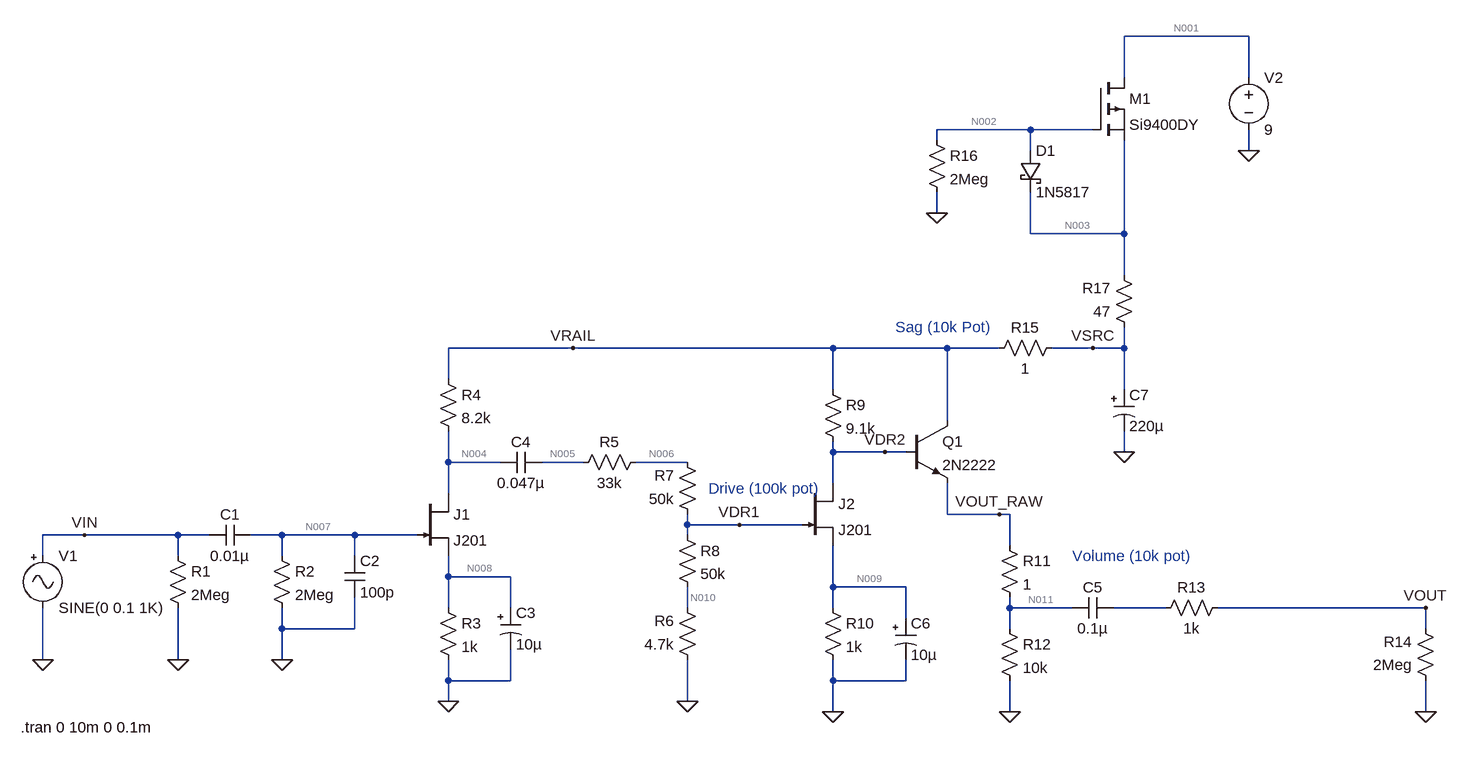
[diagram p0: schematic fairfield_barbershop.asc]
fairfield_barbershop.asc, the LTspice schematic file:
Version 4
SHEET 1 2060 680
WIRE 1664 -608 1472 -608
WIRE 1472 -544 1472 -608
WIRE 1664 -544 1664 -608
WIRE 1328 -464 1184 -464
WIRE 1424 -464 1328 -464
WIRE 1184 -448 1184 -464
WIRE 1328 -432 1328 -464
WIRE 1664 -432 1664 -464
WIRE 1184 -336 1184 -368
WIRE 1328 -304 1328 -368
WIRE 1472 -304 1472 -448
WIRE 1472 -304 1328 -304
WIRE 1472 -240 1472 -304
WIRE 624 -128 432 -128
WIRE 1024 -128 624 -128
WIRE 1200 -128 1024 -128
WIRE 1280 -128 1200 -128
WIRE 1424 -128 1360 -128
WIRE 1472 -128 1472 -160
WIRE 1472 -128 1424 -128
WIRE 432 -80 432 -128
WIRE 1024 -64 1024 -128
WIRE 1472 -64 1472 -128
WIRE 1200 -16 1200 -128
WIRE 1024 32 1024 16
WIRE 1104 32 1024 32
WIRE 1136 32 1104 32
WIRE 1472 32 1472 0
WIRE 432 48 432 0
WIRE 512 48 432 48
WIRE 640 48 576 48
WIRE 800 48 720 48
WIRE 1024 80 1024 32
WIRE 432 96 432 48
WIRE 1200 128 1200 80
WIRE 1280 128 1200 128
WIRE 1296 128 1280 128
WIRE 800 144 800 128
WIRE 880 144 800 144
WIRE 976 144 880 144
WIRE -128 160 -192 160
WIRE 16 160 -128 160
WIRE 64 160 16 160
WIRE 176 160 128 160
WIRE 288 160 176 160
WIRE 384 160 288 160
WIRE 800 160 800 144
WIRE 1296 176 1296 128
WIRE -192 192 -192 160
WIRE 16 192 16 160
WIRE 176 192 176 160
WIRE 288 192 288 160
WIRE 432 224 432 192
WIRE 528 224 432 224
WIRE 1024 240 1024 176
WIRE 1136 240 1024 240
WIRE 432 272 432 224
WIRE 528 272 528 224
WIRE 800 272 800 240
WIRE 1024 272 1024 240
WIRE 1296 272 1296 256
WIRE 1392 272 1296 272
WIRE 1536 272 1456 272
WIRE 1936 272 1616 272
WIRE 1136 288 1136 240
WIRE 176 304 176 272
WIRE 288 304 288 256
WIRE 288 304 176 304
WIRE 1296 304 1296 272
WIRE 1936 304 1936 272
WIRE -192 352 -192 272
WIRE 16 352 16 272
WIRE 176 352 176 304
WIRE 432 384 432 352
WIRE 528 384 528 336
WIRE 528 384 432 384
WIRE 1024 384 1024 352
WIRE 1136 384 1136 352
WIRE 1136 384 1024 384
WIRE 432 416 432 384
WIRE 800 416 800 352
WIRE 1024 432 1024 384
WIRE 1296 432 1296 384
WIRE 1936 432 1936 384
FLAG -192 352 0
FLAG 16 352 0
FLAG 176 352 0
FLAG 432 416 0
FLAG 800 416 0
FLAG 1936 432 0
FLAG 1296 432 0
FLAG 1024 432 0
FLAG 1936 272 VOUT
FLAG -128 160 VIN
FLAG 1184 -336 0
FLAG 1472 32 0
FLAG 1664 -432 0
FLAG 624 -128 VRAIL
FLAG 1424 -128 VSRC
FLAG 880 144 VDR1
FLAG 1104 32 VDR2
FLAG 1280 128 VOUT_RAW
SYMBOL njf 384 96 R0
SYMATTR InstName J1
SYMATTR Value J201
SYMBOL npn 1136 -16 R0
SYMATTR InstName Q1
SYMATTR Value 2N2222
SYMBOL pmos 1424 -544 R0
SYMATTR InstName M1
SYMATTR Value Si9400DY
SYMBOL Misc\\signal -192 176 R0
WINDOW 123 0 0 Left 0
WINDOW 39 0 0 Left 0
SYMATTR InstName V1
SYMATTR Value SINE(0 0.1 1K)
SYMBOL res 0 176 R0
SYMATTR InstName R1
SYMATTR Value 2Meg
SYMBOL cap 128 144 R90
WINDOW 0 0 32 VBottom 2
WINDOW 3 32 32 VTop 2
SYMATTR InstName C1
SYMATTR Value 0.01µ
SYMATTR SpiceLine V=50 Irms=0 Rser=0 Lser=0 mfg="Murata" pn="GCM155R71H103KA55" type="X7R"
SYMBOL njf 976 80 R0
SYMATTR InstName J2
SYMATTR Value J201
SYMBOL res 160 176 R0
SYMATTR InstName R2
SYMATTR Value 2Meg
SYMBOL cap 272 256 M180
WINDOW 0 24 56 Left 2
WINDOW 3 24 8 Left 2
SYMATTR InstName C2
SYMATTR Value 100p
SYMATTR SpiceLine V=50 Irms=20.8m Rser=5.448 Lser=0 mfg="KEMET" pn="C0603C101K5RAC" type="X7R"
SYMBOL res 416 256 R0
SYMATTR InstName R3
SYMATTR Value 1k
SYMBOL polcap 512 272 R0
WINDOW 3 24 56 Left 2
SYMATTR InstName C3
SYMATTR Value 10µ
SYMATTR Description Capacitor
SYMATTR Type cap
SYMATTR SpiceLine V=25 Irms=39m Rser=2.8 Lser=0 mfg="Nichicon" pn="UPR1E100MAH" type="Al electrolytic"
SYMBOL res 416 -96 R0
SYMATTR InstName R4
SYMATTR Value 8.2k
SYMBOL cap 576 32 R90
WINDOW 0 0 32 VBottom 2
WINDOW 3 32 32 VTop 2
SYMATTR InstName C4
SYMATTR Value 0.047µ
SYMATTR SpiceLine V=25 Irms=0 Rser=0 Lser=0 mfg="Murata" pn="GCM155R71E473KA55" type="X7R"
SYMBOL res 736 32 R90
WINDOW 0 0 56 VBottom 2
WINDOW 3 32 56 VTop 2
SYMATTR InstName R5
SYMATTR Value 33k
SYMBOL res 816 368 R180
WINDOW 0 36 76 Left 2
WINDOW 3 36 40 Left 2
SYMATTR InstName R6
SYMATTR Value 4.7k
SYMBOL res 816 144 R180
WINDOW 0 36 76 Left 2
WINDOW 3 36 40 Left 2
SYMATTR InstName R7
SYMATTR Value 50k
SYMBOL res 784 144 R0
SYMATTR InstName R8
SYMATTR Value 50k
SYMBOL res 1008 -80 R0
SYMATTR InstName R9
SYMATTR Value 9.1k
SYMBOL res 1008 256 R0
SYMATTR InstName R10
SYMATTR Value 1k
SYMBOL res 1280 160 R0
SYMATTR InstName R11
SYMATTR Value 1
SYMBOL res 1280 288 R0
SYMATTR InstName R12
SYMATTR Value 10k
SYMBOL cap 1456 256 R90
WINDOW 0 0 32 VBottom 2
WINDOW 3 32 32 VTop 2
SYMATTR InstName C5
SYMATTR Value 0.1µ
SYMATTR SpiceLine V=25 Irms=0 Rser=0 Lser=0 mfg="Murata" pn="GCM155R71E104KE02" type="X7R"
SYMBOL res 1632 256 R90
WINDOW 0 0 56 VBottom 2
WINDOW 3 32 56 VTop 2
SYMATTR InstName R13
SYMATTR Value 1k
SYMBOL res 1952 400 R180
WINDOW 0 36 76 Left 2
WINDOW 3 36 40 Left 2
SYMATTR InstName R14
SYMATTR Value 2Meg
SYMBOL polcap 1120 288 R0
WINDOW 3 24 56 Left 2
SYMATTR InstName C6
SYMATTR Value 10µ
SYMATTR Description Capacitor
SYMATTR Type cap
SYMATTR SpiceLine V=25 Irms=39m Rser=2.8 Lser=0 mfg="Nichicon" pn="UPR1E100MAH" type="Al electrolytic"
SYMBOL res 1376 -144 R90
WINDOW 0 0 56 VBottom 2
WINDOW 3 32 56 VTop 2
SYMATTR InstName R15
SYMATTR Value 1
SYMBOL res 1488 -144 R180
WINDOW 0 36 76 Left 2
WINDOW 3 36 40 Left 2
SYMATTR InstName R17
SYMATTR Value 47
SYMBOL voltage 1664 -560 R0
WINDOW 123 0 0 Left 0
WINDOW 39 0 0 Left 0
SYMATTR InstName V2
SYMATTR Value 9
SYMBOL res 1168 -464 R0
SYMATTR InstName R16
SYMATTR Value 2Meg
SYMBOL polcap 1456 -64 R0
WINDOW 3 24 56 Left 2
SYMATTR InstName C7
SYMATTR Value 220µ
SYMATTR Description Capacitor
SYMATTR Type cap
SYMATTR SpiceLine V=25 Irms=250m Rser=0.35 Lser=0 mfg="Nichicon" pn="UPR1E221MPH" type="Al electrolytic"
SYMBOL schottky 1312 -432 R0
SYMATTR InstName D1
SYMATTR Value 1N5817
SYMATTR Description Diode
SYMATTR Type diode
TEXT 832 88 Left 2 ;Drive (100k pot)
TEXT 1120 -160 Left 2 ;Sag (10k Pot)
TEXT 1392 192 Left 2 ;Volume (10k pot)
TEXT -226 456 Left 2 !.tran 0 10m 0 0.1m

The netlist it stands for:
* fairfield_barbershop.asc
J1 N004 N007 N008 J201
Q1 VRAIL VDR2 VOUT_RAW 0 2N2222
M1 N001 N002 N003 N003 Si9400DY
V1 VIN 0 SINE(0 0.1 1K)
R1 VIN 0 2Meg
C1 N007 VIN 0.01µ V=50 Irms=0 Rser=0 Lser=0 mfg="Murata" pn="GCM155R71H103KA55" type="X7R"
J2 VDR2 VDR1 N009 J201
R2 N007 0 2Meg
C2 0 N007 100p V=50 Irms=20.8m Rser=5.448 Lser=0 mfg="KEMET" pn="C0603C101K5RAC" type="X7R"
R3 N008 0 1k
C3 N008 0 10µ V=25 Irms=39m Rser=2.8 Lser=0 mfg="Nichicon" pn="UPR1E100MAH" type="Al electrolytic"
R4 VRAIL N004 8.2k
C4 N005 N004 0.047µ V=25 Irms=0 Rser=0 Lser=0 mfg="Murata" pn="GCM155R71E473KA55" type="X7R"
R5 N006 N005 33k
R6 0 N010 4.7k
R7 VDR1 N006 50k
R8 VDR1 N010 50k
R9 VRAIL VDR2 9.1k
R10 N009 0 1k
R11 VOUT_RAW N011 1
R12 N011 0 10k
C5 N012 N011 0.1µ V=25 Irms=0 Rser=0 Lser=0 mfg="Murata" pn="GCM155R71E104KE02" type="X7R"
R13 VOUT N012 1k
R14 0 VOUT 2Meg
C6 N009 0 10µ V=25 Irms=39m Rser=2.8 Lser=0 mfg="Nichicon" pn="UPR1E100MAH" type="Al electrolytic"
R15 VSRC VRAIL 1
R17 VSRC N003 47
V2 N001 0 9
R16 N002 0 2Meg
C7 VSRC 0 220µ V=25 Irms=250m Rser=0.35 Lser=0 mfg="Nichicon" pn="UPR1E221MPH" type="Al electrolytic"
D1 N002 N003 1N5817
.model D D
.lib standard.dio
.model NPN NPN
.model PNP PNP
.lib standard.bjt
.model NJF NJF
.model PJF PJF
.lib standard.jft
.model NMOS NMOS
.model PMOS PMOS
.lib standard.mos
* Drive (100k pot)
* Sag (10k Pot)
* Volume (10k pot)
.tran 0 10m 0 0.1m
.backanno
.end

* Results of the author's LTspice run, read from the files saved beside the schematic
* Operating Point, zero values left out:
*   V(n004) = 5.533 V
*   V(n007) = 11.79 µV
*   V(n008) = 357.5 mV
*   V(vrail) = 8.465 V
*   V(vdr2) = 5.195 V
*   V(vout_raw) = 4.561 V
*   V(n001) = 9 V
*   V(n002) = 8.516 V
*   V(n003) = 8.521 V
*   V(vdr1) = 303.9 nV
*   V(n009) = 357.2 mV
*   V(n005) = 303.9 nV
*   V(n006) = 303.9 nV
*   V(n010) = 26.11 nV
*   V(n011) = 4.56 V
*   V(vsrc) = 8.466 V
*   Ic(Q1) = 453.8 µA
*   Ib(Q1) = 2.201 µA
*   Ie(Q1) = -456 µA
*   Id(M1) = 1.175 mA
*   Is(M1) = -1.175 mA
*   I(D1) = -4.258 µA
*   Id(J2) = 357.2 µA
*   Ig(J2) = -5.556 pA
*   Is(J2) = -357.2 µA
*   Id(J1) = 357.5 µA
*   Ig(J1) = -5.895 pA
*   Is(J1) = -357.5 µA
*   I(R16) = 4.258 µA
*   I(R17) = -1.171 mA
*   I(R15) = 1.171 mA
*   I(R12) = 456 µA
*   I(R11) = 456 µA
*   I(R10) = 357.2 µA
*   I(R9) = 359.4 µA
*   I(R8) = 5.556 pA
*   I(R6) = -5.556 pA
*   I(R4) = 357.5 µA
*   I(R3) = 357.5 µA
*   I(R2) = 5.895 pA
*   I(V2) = -1.175 mA
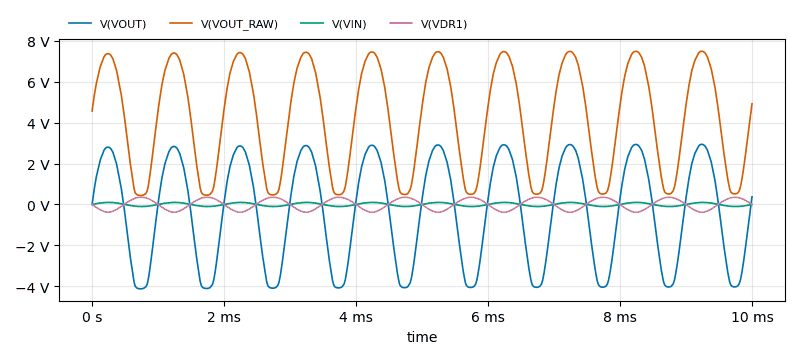
[diagram p1: Transient Analysis of fairfield_barbershop.asc, plotted from the saved traces]
* Transient Analysis, 1 run:
*   V(VOUT): min -4.12 V, max 2.937 V, average -395.6 mV, rms 2.625 V, last 375.8 mV
*   V(VOUT_RAW): min 438.8 mV, max 7.485 V, average 4.157 V, rms 4.902 V, last 4.918 V
*   V(VIN): min -99.99 mV, max 100 mV, average -100.6 µV, rms 70.93 mV, last 0 V
*   V(VDR1): min -380.1 mV, max 354.3 mV, average 2.295 mV, rms 257.8 mV, last -3.631 mV